# Altium schematic sheet RF.SchDoc
size A3
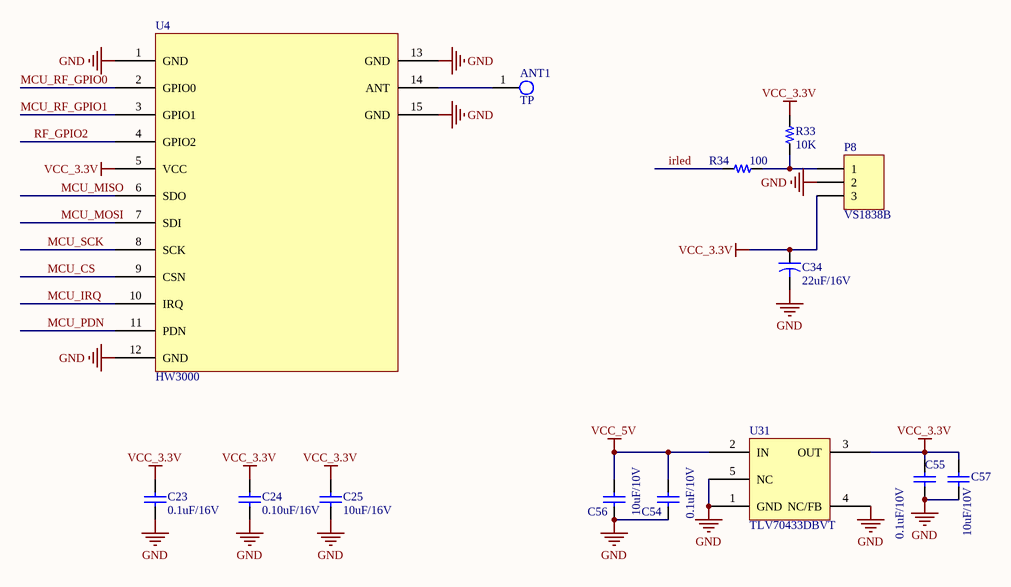
[diagram p0: RF.SchDoc]

## Parts
ANT1  TP  [ANT_TH]
C23  0.1uF/16V  [0603C]
C24  0.10uF/16V  [0603C]
C25  10uF/16V  [0603C]
C34  22uF/16V  [0805C]
C54  0.1uF/10V  [0603C]
C55  0.1uF/10V  [0603C]
C56  10uF/10V  [0603C]
C57  10uF/10V  [0603C]
P8  VS1838B  [VS1838B]
R33  10K  [0603R]
R34  100  [0603R]
U4  HW3000  [HW3000]
U31  TLV70433DBVT  [SOT23-5(DBV)]

## Nets
GND: C23.2 C24.2 C25.2 C34.2 C54.2 C55.2 C56.1 C57.1 P8.2 U4.1(GND) U4.12(GND) U4.13(GND) U4.15(GND) U31.1(GND) U31.4(NC/FB) U31.5(NC)
VCC_3.3V: C23.1 C24.1 C25.1 C34.1 C55.1 C57.2 P8.3 R33.2 U4.5(VCC) U31.3(OUT)
VCC_5V: C54.1 C56.2 U31.2(IN)
irled: R34.2
MCU_CS: U4.9(CSN)
MCU_IRQ: U4.10(IRQ)
MCU_MISO: U4.6(SDO)
MCU_MOSI: U4.7(SDI)
MCU_PDN: U4.11(PDN)
MCU_RF_GPIO0: U4.2(GPIO0)
MCU_RF_GPIO1: U4.3(GPIO1)
MCU_SCK: U4.8(SCK)
RF_GPIO2: U4.4(GPIO2)
NetANT1_1: ANT1.1 U4.14(ANT)
NetP8_1: P8.1 R33.1 R34.1

## Library data of the parts
C23-C25 = Cap: Capacitor; Value: 2.2uF/6.3V; Published: 8-Jun-2000; LatestRevisionDate: 17-Jul-2002; LatestRevisionNote: Re-released for DXP Platform.; PackageReference: RAD-0.3; Publisher: Altium Limited
C34 = Cap2: Capacitor; Value: 10uF/16V; Published: 23-Sep-2002; PackageReference: CAPR5-4X5; Publisher: Altium Limited
C54 C55 = Cap: Capacitor; Value: 104; Published: 8-Jun-2000; LatestRevisionDate: 17-Jul-2002; LatestRevisionNote: Re-released for DXP Platform.; PackageReference: RAD-0.3; Publisher: Altium Limited
C56 = Cap: Capacitor; Value: 106/50V; Published: 8-Jun-2000; LatestRevisionDate: 17-Jul-2002; LatestRevisionNote: Re-released for DXP Platform.; PackageReference: RAD-0.3; Publisher: Altium Limited
C57 = Cap: Capacitor; Published: 8-Jun-2000; LatestRevisionDate: 17-Jul-2002; LatestRevisionNote: Re-released for DXP Platform.; PackageReference: RAD-0.3; Publisher: Altium Limited; Value: 10uF/10V
P8 = Header 3: Header, 3-Pin; LatestRevisionDate: 17-Jul-2002; LatestRevisionNote: Re-released for DXP Platform.; Publisher: Altium Limited
R33 R34 = R
U31 = TPS76318